# EAGLE design kolrs868_rx (EAGLE 6.4)
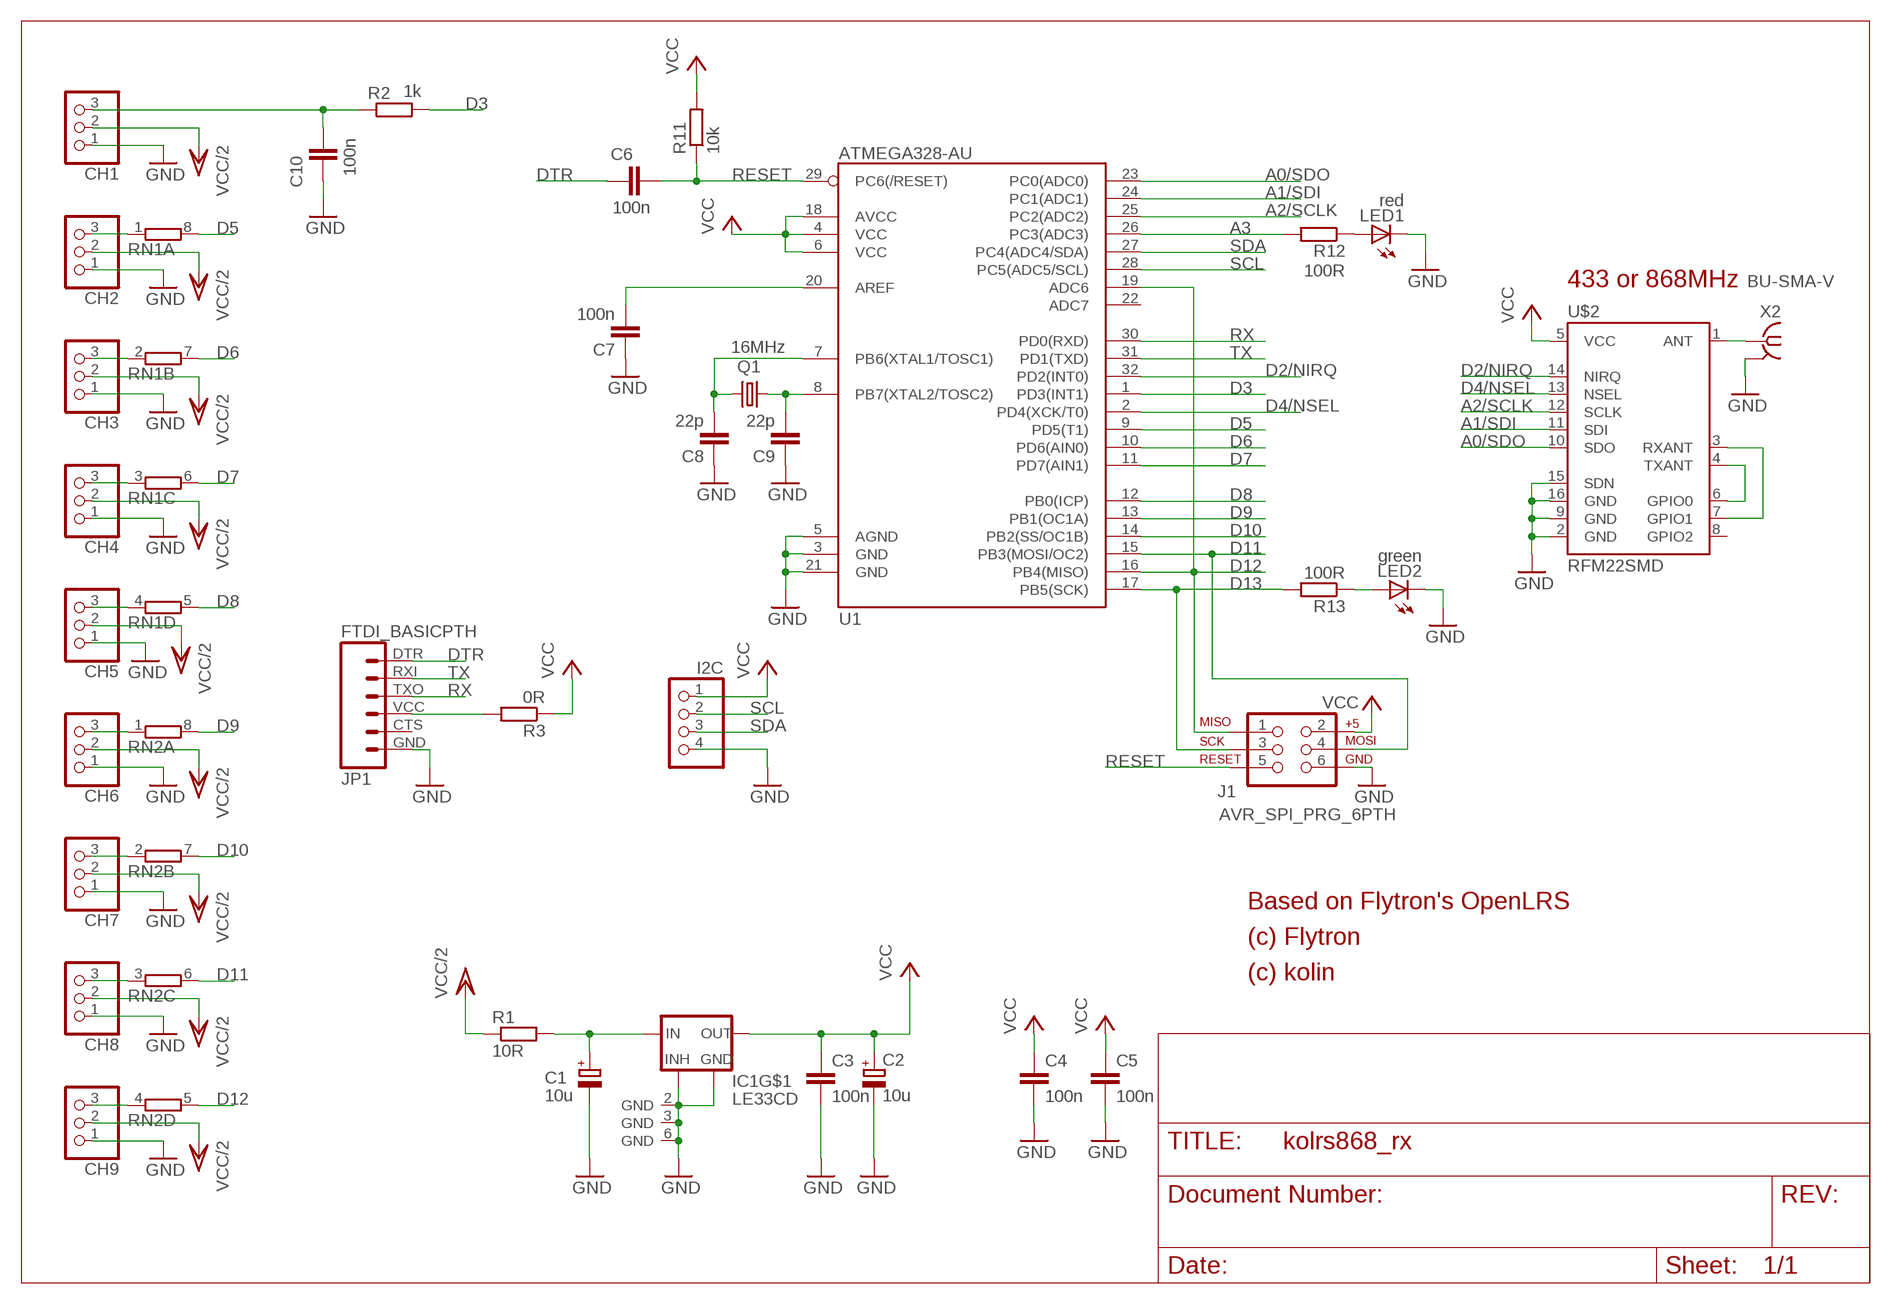
[diagram p0: schematic, sheet 1]

## Parts
C1  10u  CPOL-EUSMCB  [SMC_B]
C2  10u  CPOL-EUSMCB  [SMC_B]
C3  100n  C-EU_KOLIN  [M0805]
C4  100n  C-EU_KOLIN  [M0805]
C5  100n  C-EU_KOLIN  [M0805]
C6  100n  C-EU_KOLIN  [M0805]
C7  100n  C-EU_KOLIN  [M0805]
C8  22p  C-EU_KOLIN  [M0805]
C9  22p  C-EU_KOLIN  [M0805]
C10  100n  C-EU_KOLIN  [M0805]
CH1  PINHD-1X3_KOLINOVO  [1X03]
CH2  PINHD-1X3_KOLINOVO  [1X03]
CH3  PINHD-1X3_KOLINOVO  [1X03]
CH4  PINHD-1X3_KOLINOVO  [1X03]
CH5  PINHD-1X3_KOLINOVO  [1X03]
CH6  PINHD-1X3_KOLINOVO  [1X03]
CH7  PINHD-1X3_KOLINOVO  [1X03]
CH8  PINHD-1X3_KOLINOVO  [1X03]
CH9  PINHD-1X3_KOLINOVO  [1X03]
I2C  PINHD-1X4  [1X04]
IC1  LE33CD  [SO8]
J1  AVR_SPI_PRG_6PTH  [2X3]
JP1  FTDI_BASICPTH  [FTDI_BASIC]
LED1  red  LEDCHIPLED_0805  [CHIPLED_0805]
LED2  green  LEDCHIPLED_0805  [CHIPLED_0805]
Q1  16MHz  CRYSTALHC49UP  [HC49UP]
R1  10R  R-EU_KOLINM0805  [M0805]
R2  1k  R-EU_KOLINM0805  [M0805]
R3  0R  R-EU_KOLINM0805  [M0805]
R11  10k  R-EU_KOLINM0805  [M0805]
R12  100R  R-EU_KOLINM0805  [M0805]
R13  100R  R-EU_KOLINM0805  [M0805]
RN1  4R-NCAY16  [CAY16]
RN2  4R-NCAY16  [CAY16]
U1  ATMEGA328-AU  ATMEGA168  [TQFP32-08]
U$2  RFM22SMD  [RFM22-XXX-S2]
X2  BU-SMA-V  [BU-SMA-V]

## Nets
A0/SDO: U1.23(PC0(ADC0)) U$2.10(SDO)
A1/SDI: U1.24(PC1(ADC1)) U$2.11(SDI)
A2/SCLK: U1.25(PC2(ADC2)) U$2.12(SCLK)
A3: R12.2 U1.26(PC3(ADC3))
D2/NIRQ: U1.32(PD2(INT0)) U$2.14(NIRQ)
D3: R2.2 U1.1(PD3(INT1))
D4/NSEL: U1.2(PD4(XCK/T0)) U$2.13(NSEL)
D5: RN1.8 U1.9(PD5(T1))
D6: RN1.7 U1.10(PD6(AIN0))
D7: RN1.6 U1.11(PD7(AIN1))
D8: RN1.5 U1.12(PB0(ICP))
D9: RN2.8 U1.13(PB1(OC1A))
D10: RN2.7 U1.14(PB2(SS/OC1B))
D11: J1.4 RN2.6 U1.15(PB3(MOSI/OC2))
D12: J1.1 RN2.5 U1.16(PB4(MISO)) U1.19(ADC6)
D13: J1.3 R13.2 U1.17(PB5(SCK))
DTR: C6.1 JP1.DTR
GND: C1.- C2.- C3.2 C4.2 C5.2 C7.1 C8.1 C9.1 C10.1 CH1.1 CH2.1 CH3.1 CH4.1 CH5.1 CH6.1 CH7.1 CH8.1 CH9.1 I2C.4 IC1.2(GND) IC1.3(GND) IC1.5(INHIBIT) IC1.6(GND) IC1.7(GND) J1.6 JP1.GND LED1.C LED2.C U1.3(GND) U1.5(AGND) U1.21(GND) U$2.2(GND) U$2.9(GND) U$2.15(SDN) U$2.16(GND) X2.2(GND)
N$1: C7.2 U1.20(AREF)
N$2: U$2.4(TXANT) U$2.6(GPIO0)
N$3: U$2.3(RXANT) U$2.7(GPIO1)
N$4: U$2.1(ANT) X2.1
N$5: LED1.A R12.1
N$6: C8.2 Q1.2 U1.7(PB6(XTAL1/TOSC1))
N$7: C9.2 Q1.1 U1.8(PB7(XTAL2/TOSC2))
N$8: JP1.VCC R3.2
N$9: C1.+ IC1.8(IN) R1.2
N$11: CH5.3 RN1.4
N$12: C10.2 CH1.3 R2.1
N$14: CH2.3 RN1.1
N$15: CH3.3 RN1.2
N$16: CH4.3 RN1.3
N$17: CH6.3 RN2.1
N$18: CH7.3 RN2.2
N$19: CH8.3 RN2.3
N$20: CH9.3 RN2.4
N$25: LED2.A R13.1
RESET: C6.2 J1.5 R11.1 U1.29(PC6(/RESET))
RX: JP1.TXO U1.30(PD0(RXD))
SCL: I2C.2 U1.28(PC5(ADC5/SCL))
SDA: I2C.3 U1.27(PC4(ADC4/SDA))
TX: JP1.RXI U1.31(PD1(TXD))
VCC: C2.+ C3.1 C4.1 C5.1 I2C.1 IC1.1(OUT) J1.2 R3.1 R11.2 U1.4(VCC) U1.6(VCC) U1.18(AVCC) U$2.5(VCC)
VCC/2: CH1.2 CH2.2 CH3.2 CH4.2 CH5.2 CH6.2 CH7.2 CH8.2 CH9.2 R1.1
Unconnected: JP1.CTS U1.22(ADC7) U$2.8(GPIO2)

## Notes on the sheet
- 433 or 868MHz
- Based on Flytron's OpenLRS
- (c) Flytron
- (c) kolin

## Power pins joined to a net without a drawn wire
GND: X2.3(GND) X2.4(GND) X2.5(GND)

## Library data of the parts
C1 C2 = rcl:CPOL-EU: POLARIZED CAPACITOR, European symbol
C3-C10 = PINHEAD_RC:C-EU_KOLIN: CAPACITOR, European symbol
CH1-CH9 = PINHEAD_RC:PINHD-1X3_KOLINOVO: KOLINOVO PIN HEADER
I2C = pinhead:PINHD-1X4: PIN HEADER
IC1 = libstabilizatory:LE33CD: VOLTAGE REGULATOR WITH INHIBIT
J1 = SparkFun:AVR_SPI_PRG_6: AVR ISP 6 Pin This is the reduced ISP connector for AVR programming. Common on Arduino. This footprint will take up less PCB space and can be used with a 10-pin to 6-pin adapter such as SKU: BOB-08508
JP1 = SparkFun:FTDI_BASIC: FTDI Basic: 3.3V and 5V
LED1 LED2 = led:LED: LED OSRAM: - CHIPLED LG R971, LG N971, LY N971, LG Q971, LY Q971, LO R971, LY R971 LH N974, LH R974 LS Q976, LO Q976, LY Q976 LO Q996 - Hyper CHIPLED LW Q18S LB Q993, LB Q99A, LB R99A - SideLED LS A670, LO A670, LY A670, LG A670, LP A670 LB A673, LV A673, LT A673, LW A673 LH A674 LY A675 LS A676, LA A676, LO A676, LY A676, LW A676 LS A679, LY A679, LG A679 - Hyper Micro SIDELED® LS Y876, LA Y876, LO Y876, LY Y876 LT Y87S - SmartLED LW L88C, LW L88S LB L89C, LB L89S, LG L890 LS L89K, LO L89K, LY L89K LS L896, LA L896, LO L896, LY L896 - TOPLED LS T670, LO T670, LY T670, LG T670, LP T670 LSG T670, LSP T670, LSY T670, LOP T670, LYG T670 LG T671, LOG T671, LSG T671 LB T673, LV T673, LT T673, LW T673 LH T674 LS T676, LA T676, LO T676, LY T676, LB T676, LH T676, LSB T676, LW T676 LB T67C, LV T67C, LT T67C, LS T67K, LO T67K, LY T67K, LW E67C LS E67B, LA E67B, LO E67B, LY E67B, LB E67C, LV E67C, LT E67C LW T67C LS T679, LY T679, LG T679 LS T770, LO T770, LY T770, LG T770, LP T770 LB T773, LV T773, LT T773, LW T773 LH T774 LS E675, LA E675, LY E675, LS T675 LS T776, LA T776, LO T776, LY T776, LB T776 LHGB T686 LT T68C, LB T68C - Hyper Mini TOPLED® LB M676 - Mini TOPLED Santana® LG M470 LS M47K, LO M47K, LY M47K Source: http://www.osram.convergy.de LUXEON: - LUMILED® LXK2-PW12-R00, LXK2-PW12-S00, LXK2-PW14-U00, LXK2-PW14-V00 LXK2-PM12-R00, LXK2-PM12-S00, LXK2-PM14-U00 LXK2-PE12-Q00, LXK2-PE12-R00, LXK2-PE12-S00, LXK2-PE14-T00, LXK2-PE14-U00 LXK2-PB12-K00, LXK2-PB12-L00, LXK2-PB12-M00, LXK2-PB14-N00, LXK2-PB14-P00, LXK2-PB14-Q00 LXK2-PR12-L00, LXK2-PR12-M00, LXK2-PR14-Q00, LXK2-PR14-R00 LXK2-PD12-Q00, LXK2-PD12-R00, LXK2-PD12-S00 LXK2-PH12-R00, LXK2-PH12-S00 LXK2-PL12-P00, LXK2-PL12-Q00, LXK2-PL12-R00 Source: www.luxeon.com KINGBRIGHT: KA-3528ASYC Source: www.kingbright.com
Q1 = crystal:CRYSTAL: CRYSTAL; OC_FARNELL: unknown; OC_NEWARK: unknown
R1-R3 R11-R13 = PINHEAD_RC:R-EU_KOLIN: RESISTOR, European symbol
RN1 RN2 = resistor-dil:4R-N: Array Chip Resistor Source: RS Component / Phycomp; OC_FARNELL: unknown; OC_NEWARK: unknown
U1 = SparkFun:ATMEGA168
U$2 = SparkFun:RFM22: Description: The RFM22 is a low-power, low cost radio that is capable of operating in the 434MHz and 900MHz open bands. It's frequency is software defined and there are some very good libraries written for it.
X2 = con-coax:BU-SMA-V: FEMALE SMA CONNECTOR Radiall distributor RS 112-3794; OC_FARNELL: unknown; OC_NEWARK: unknown

## Board
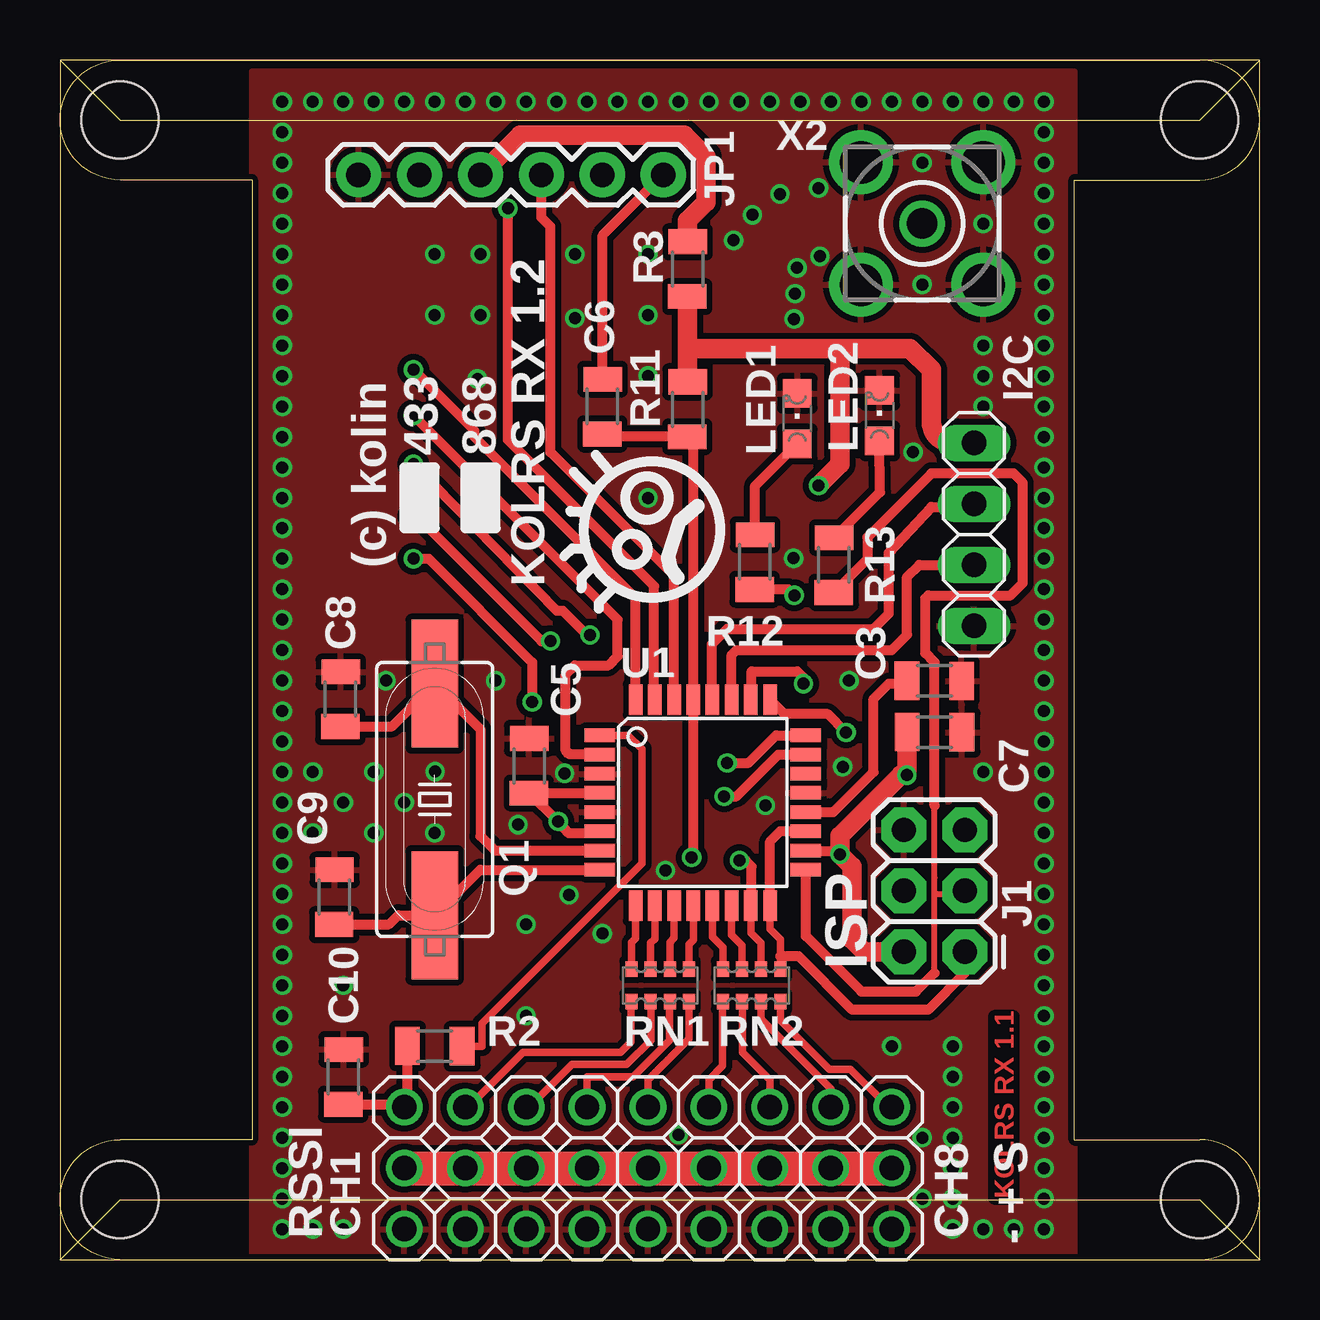
[diagram p1: board, top side]
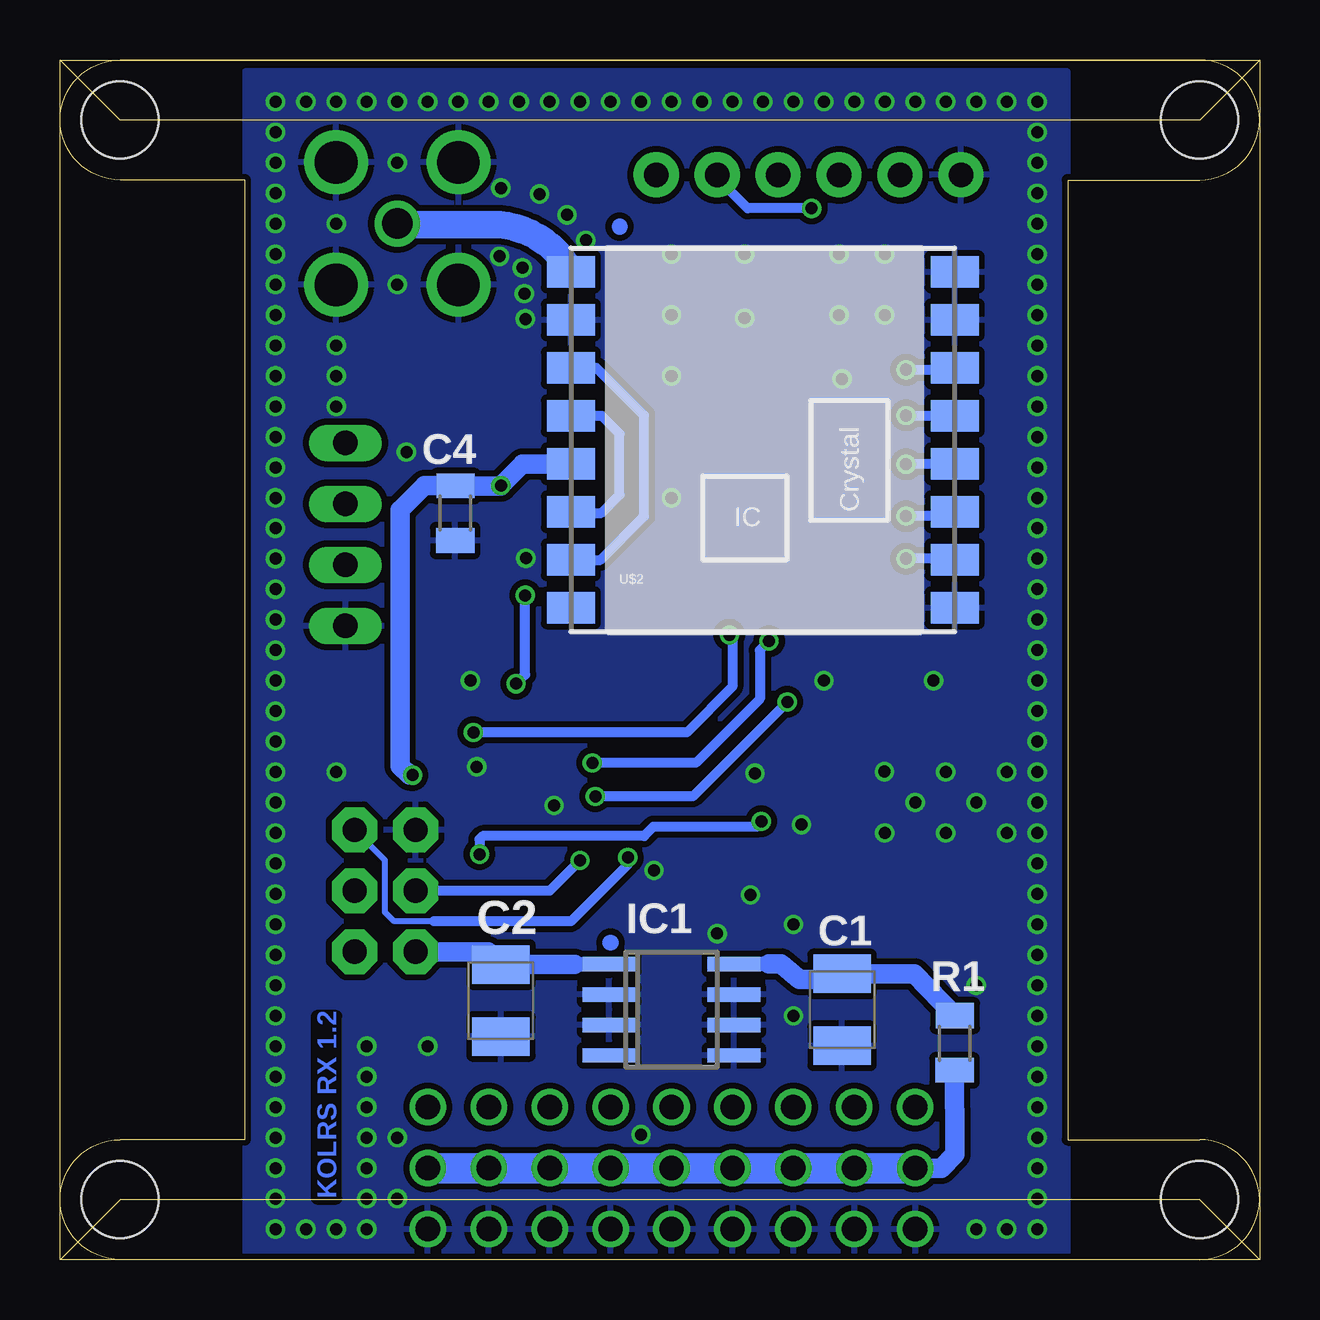
[diagram p2: board, bottom side, seen from below]

Size 50 x 50 mm. Coordinates in mm from the lower left corner, seen from the top.
Outline: 2.5,0 47.5,0 arc180 47.5,5 42.29,5 42.29,45 47.5,45 arc180 47.5,50 2.5,50 arc180 2.5,45 8,45 8,5 2.5,5 arc180 2.5,0
Copper layers (1*16): Top 0.035mm / dielectric 1.5mm / Bottom 0.035mm
Design rules "ITEADstudio_DRC": minimum track width 6mil, minimum drill 12mil, track to track 6mil, track to pad 6mil, pad to pad 6mil, via to via 6mil, smd to smd 0mil, copper to edge 10mil, drill to drill 10mil, minimum pad ring 10mil, minimum via ring 6mil, stop-mask expansion 2mil, vias tented up to drill 100mil, thermal gap 10mil
Holes 3.2 mm at 2.5,2.5 47.5,2.5 47.5,47.5 2.5,47.5
Milling: 10 lines

### Footprints (pad centres in the part's own frame; a part is rotated, then mirrored left to right if it is on the bottom)
SMC_B = smd 1.6 x 2.4: + -1.5,0; - 1.5,0
M0805 = smd 1.021 x 1.6: 1 -1.131,0.017 | smd 1.046 x 1.6: 2 1.148,0
1X03 = drill 1.016: 1 -2.54,0; 2 0,0; 3 2.54,0
1X04 = drill 1.016 long: 1 -3.81,0; 2 -1.27,0; 3 1.27,0; 4 3.81,0
SO8 = smd 0.6 x 2.2: 1 -1.905,-2.6; 2 -0.635,-2.6; 3 0.635,-2.6; 4 1.905,-2.6; 5 1.905,2.6; 6 0.635,2.6; 7 -0.635,2.6; 8 -1.905,2.6
2X3 = drill 1.016 pad 1.88 octagon: 1 0,0; 2 0,2.54; 3 2.54,0; 4 2.54,2.54; 5 5.08,0; 6 5.08,2.54
FTDI_BASIC = drill 1.016 pad 1.88: CTS 10.16,0; DTR 0,0; GND 12.7,0; RXI 2.54,0; TXO 5.08,0; VCC 7.62,0
CHIPLED_0805 = smd 1.2 x 1.2: A 0,-1.05; C 0,1.05
HC49UP = smd 5.334 x 1.93: 1 -4.826,0; 2 4.826,0
CAY16 = smd 0.5 x 0.65: 1 -1.2,-0.675; 2 -0.4,-0.675; 3 0.4,-0.675; 4 1.2,-0.675; 5 1.2,0.675; 6 0.4,0.675; 7 -0.4,0.675; 8 -1.2,0.675
TQFP32-08 = smd 1.27 x 0.559: 1 -4.293,2.8; 2 -4.293,2; 3 -4.293,1.2; 4 -4.293,0.4; 5 -4.293,-0.4; 6 -4.293,-1.2; 7 -4.293,-2; 8 -4.293,-2.8; 17 4.293,-2.8; 18 4.293,-2; 19 4.293,-1.2; 20 4.293,-0.4; 21 4.293,0.4; 22 4.293,1.2; 23 4.293,2; 24 4.293,2.8 | smd 0.559 x 1.27: 9 -2.8,-4.293; 10 -2,-4.293; 11 -1.2,-4.293; 12 -0.4,-4.293; 13 0.4,-4.293; 14 1.2,-4.293; 15 2,-4.293; 16 2.8,-4.293; 25 2.8,4.293; 26 2,4.293; 27 1.2,4.293; 28 0.4,4.293; 29 -0.4,4.293; 30 -1.2,4.293; 31 -2,4.293; 32 -2.8,4.293
RFM22-XXX-S2 = smd 2 x 1.3: 1 -8,7; 2 -8,5; 3 -8,3; 4 -8,1; 5 -8,-1; 6 -8,-3; 7 -8,-5; 8 -8,-7; 9 8,-7; 10 8,-5; 11 8,-3; 12 8,-1; 13 8,1; 14 8,3; 15 8,5; 16 8,7
BU-SMA-V = drill 1.27: 1 0,0 | drill 1.778: 2 -2.55,2.55; 3 2.55,2.55; 4 2.55,-2.55; 5 -2.55,-2.55

### Placement (x,y rotation side)
C1  17.4,10.41 270 bottom
C2  31.62,10.79 270 bottom
C3  36.45,21.97 0 top
C4  33.53,31.11 270 bottom
C5  19.56,20.57 90 top
C6  22.61,35.56 270 top
C7  36.45,24.13 180 top
C8  11.68,23.37 270 top
C9  11.43,15.11 270 top
C10  11.81,7.62 270 top
CH1  14.35,3.81 90 top
CH2  16.89,3.81 90 top
CH3  19.43,3.81 90 top
CH4  21.97,3.81 90 top
CH5  24.51,3.81 90 top
CH6  27.05,3.81 90 top
CH7  29.59,3.81 90 top
CH8  32.13,3.81 90 top
CH9  34.67,3.81 90 top
I2C  38.1,30.23 270 top
IC1  24.51,10.41 270 bottom
J1  37.72,12.83 90 top
JP1  25.14,45.21 180 top
LED1  30.73,35.05 0 top
LED2  34.16,35.18 0 top
Q1  15.62,19.18 90 top
R1  12.7,9.02 90 bottom
R2  15.62,8.89 0 top
R3  26.16,41.27 90 top
R11  26.16,35.43 90 top
R12  28.95,29.08 270 top
R13  32.26,28.96 270 top
RN1  25.02,11.43 0 top
RN2  28.83,11.43 0 top
U1  26.8,19.05 0 top
U$2  20.7,34.16 0 bottom
X2  35.94,43.18 0 top

### Tracks (layer width: path | path; a pad name or v marks a point on that pad's centre or on a via)
A0/SDO  (via drill 0.5)
  Top 0.406: v14.73,29.21 15.37,29.21 19.68,24.89 v19.68,23.24 | U1.23 29.94,21.05 28.19,19.3 v27.68,19.3
  Bottom 0.406: U$2.10 12.75,29.21 v14.73,29.21 | v27.68,19.3 23.62,19.3 v19.68,23.24
A1/SDI  (via drill 0.5)
  Top 0.406: v14.73,30.99 14.86,30.99 20.06,25.78 v20.45,25.78 | U1.24 29.84,21.84 28.7,20.7 v27.81,20.7
  Bottom 0.406: U$2.11 12.88,30.99 v14.73,30.99 | v20.45,25.78 20.83,25.4 20.83,23.37 23.49,20.7 v27.81,20.7
A2/SCLK  (via drill 0.5)
  Top 0.406: U1.25 30.21,22.73 32,22.73 v32.77,21.97 | v14.73,33.15 20.7,27.05 20.95,27.05 21.97,26.04 v22.1,26.04
  Bottom 0.406: U$2.12 12.72,33.15 v14.73,33.15 | v22.1,26.04 21.97,25.91 21.97,23.88 23.88,21.97 v32.77,21.97
A3  (via drill 0.5)
  Top 0.406: U1.26 28.83,23.38 28.83,24.51 30.73,24.51 30.99,24.26 v30.99,24 | v30.61,27.69 30.36,27.93 R12.2
  Bottom 0.406: v30.99,24 30.61,24.38 v30.61,27.69
D2/NIRQ  (via drill 0.5)
  Top 0.406: U1.32 24,27.57 17.27,34.29 17.27,34.54 v14.73,37.08
  Bottom 0.406: U$2.14 12.78,37.08 v14.73,37.08
D3
  Top 0.305: R2.2 17.59,8.89 17.59,9.84 24.26,16.51 24.26,21.27 23.68,21.85 U1.1
D4/NSEL  (via drill 0.5)
  Top 0.406: U1.2 22.47,21.08 21.21,21.08 21.08,21.21 21.08,24.38 21.46,24.77 22.86,24.77 23.24,25.15 23.24,26.67 v14.73,35.18
  Bottom 0.406: v14.73,35.18 12.72,35.18 U$2.13
D5
  Top 0.305: U1.9 24,13.39 23.82,13.21 RN1.8
D6
  Top 0.305: U1.10 24.8,13.37 24.62,13.19 RN1.7
D7
  Top 0.305: U1.11 25.6,13.4 25.42,13.23 RN1.6
D8
  Top 0.305: U1.12 26.4,13.32 26.22,13.14 RN1.5
D9
  Top 0.305: U1.13 27.2,13.44 27.63,13.01 RN2.8
D10
  Top 0.305: U1.14 28,13.53 28.43,13.1 RN2.7
D11  (via drill 0.5)
  Top 0.305: U1.15 28.8,13.62 29.23,13.19 RN2.6
  Top 0.406: U1.15 28.83,14.79 28.83,16.38 28.57,16.64 v28.32,16.64
  Bottom 0.406: v28.32,16.64 29.59,15.37 J1.4
D12
  Top 0.305: U1.16 29.6,13.77 30.04,13.34 30.03,13.33 30.03,12.64 RN2.5
  Top 0.406: U1.19 31.08,17.86 30.03,17.86 29.6,17.43 U1.16 | J1.1 37.72,11.94 36.19,10.41 33.02,10.41 30.8,12.64 30.03,12.64
D13
  Top 0.254: 36.45,18.92 36.45,15.93 36.45,15.24 | 36.45,11.94 36.45,15.24 | 36.45,15.24 37.59,15.24
  Top 0.305: 36.45,18.92 | 37.59,15.24 J1.3
  Top 0.406: U1.17 31.09,13.49 33.4,11.18 35.69,11.18 36.45,11.94 | R13.2 33.65,29.2 33.65,30.1 36.32,32.77 39.75,32.77 40.13,32.38 40.13,28.19 39.62,27.69 36.19,27.69 36.07,27.56 36.07,25.27 36.45,24.89 36.45,18.92
DTR
  Top 0.406: JP1.DTR 22.62,42.69 C6.1
GND  (via drill 0.5)
  other vias: 29.41,18.93 9.27,1.27 9.27,3.81 9.27,6.35 9.27,8.89 9.27,11.43 9.27,13.97 9.27,16.51 9.27,19.05 11.81,19.05 14.35,19.05 19.43,13.97 9.27,21.59 9.27,24.13 9.27,26.67 9.27,29.21 9.27,31.75 9.27,34.29 9.27,39.37 9.27,41.91 9.27,44.45 9.27,46.99 10.54,48.26 15.62,48.26 18.16,48.26 20.7,48.26 23.24,48.26 25.78,48.26 28.32,48.26 30.86,48.26 33.4,48.26 35.94,48.26 38.48,48.26 41.02,48.26 18.16,24.13 30.01,44.41 35.94,40.64 38.48,43.18 35.94,45.72 41.02,45.72 41.02,43.18 41.02,40.64 41.02,38.1 38.48,38.1 41.02,35.56 38.48,35.56 41.02,33.02 41.02,30.48 41.02,27.94 41.02,25.4 41.02,22.86 38.48,20.32 41.02,17.78 41.02,15.24 41.02,12.7 41.02,10.16 41.02,7.62 35.94,5.08 41.02,5.08 41.02,2.54 35.94,2.54 11.81,11.43 19.09,18.13 21.22,15.19 32.63,20.54 30.58,29.23 24.51,31.75 24.51,36.83 24.51,39.37 24.51,41.91 15.62,41.91 15.62,39.37 13.08,48.26 9.27,36.83 21.46,39.24 21.46,41.91 17.52,39.37 17.52,41.91 17.4,36.7 13.59,24.13 22.61,13.59 32.89,24.13 9.27,20.32 9.27,17.78 9.27,15.24 9.27,12.7 9.27,10.16 9.27,7.62 9.27,5.08 9.27,2.54 9.27,22.86 9.27,25.4 9.27,27.94 9.27,30.48 9.27,33.02 9.27,35.56 9.27,38.1 9.27,40.64 9.27,43.18 9.27,45.72 9.27,48.26 11.81,48.26 14.35,48.26 16.89,48.26 19.43,48.26 21.97,48.26 24.51,48.26 27.05,48.26 29.59,48.26 32.13,48.26 34.67,48.26 37.21,48.26 39.75,48.26 41.02,46.99 41.02,44.45 41.02,41.91 41.02,39.37 41.02,36.83 41.02,34.29 41.02,31.75 41.02,29.21 41.02,26.67 41.02,24.13 41.02,19.05 41.02,16.51 41.02,13.97 41.02,11.43 41.02,8.89 41.02,6.35 41.02,3.81 41.02,1.27 15.62,17.78 13.08,17.78 10.54,17.78 10.54,20.32 13.08,20.32 21.03,20.27 31.62,44.66 28.86,43.55 28.08,42.48 30.6,39.2 30.65,40.26 30.73,41.33 31.68,41.82 25.24,16.22 15.63,20.34 41.02,21.59 41.02,20.32 25.78,5.21 37.21,8.89 37.21,7.62 37.21,6.35 37.21,5.08 37.21,3.81 37.21,2.54 35.56,33.66 38.48,36.83 39.75,1.27 38.48,1.27 37.21,1.27 34.67,8.89 19.43,10.16 10.54,1.27 11.81,1.27
  pour Bottom (isolate 0.254): 8,49.53 42.29,49.53 42.29,0 8,0
  pour Top (isolate 0.254): 8,49.53 42.29,49.53 42.29,0 8,0
N$1
  Top 0.406: C7.2 35.17,24 34.54,24 33.91,23.37 33.91,20.32 32.24,18.65 U1.20
N$2
  Bottom 0.406: U$2.4 27.41,35.16 26.67,34.42 26.67,31.88 27.43,31.11 28.65,31.11 U$2.6
N$3
  Bottom 0.406: U$2.3 27.64,37.16 25.65,35.18 25.65,30.99 27.48,29.16 U$2.7
N$4
  Bottom 1.143: U$2.1 arc-62 32.02,43.15 35.91,43.15
  Bottom 1.27: 35.91,43.15 arc90 X2.1
N$5
  Top 0.406: R12.1 28.97,32.24 LED1.A
N$6
  Top 0.406: C8.2 13.84,22.23 Q1.2 17.52,22.1 17.52,17.65 18.13,17.05 U1.7
N$7
  Top 0.406: C9.2 13.71,13.97 14.1,14.35 Q1.1 17.52,16.25 U1.8
N$8
  Top 0.813: JP1.VCC 19.18,46.86 26.03,46.86 26.92,45.97 26.92,44.07 26.16,43.31 R3.2
N$9
  Bottom 0.61: IC1.8 20.45,12.32
  Bottom 0.813: R1.2 14.38,11.91 C1.+ | C1.+ 17.8,12.06 | 20.45,12.32 19.94,12.32 19.18,11.68 17.42,11.68 C1.+
N$11
  Top 0.305: CH5.3 24.51,7.49 26.22,9.21 26.22,10.73 RN1.4
N$12
  Top 0.406: C10.2 14.23,6.47 CH1.3 14.49,6.49 R2.1
N$14
  Top 0.305: CH2.3 17.08,6.41 19.3,8.64 23.37,8.64 23.81,9.08 23.81,10.73 RN1.1
N$15
  Top 0.305: CH3.3 19.62,6.41 21.34,8.13 23.62,8.13 24.64,9.14 24.64,10.73 RN1.2
N$16
  Top 0.305: CH4.3 21.97,7.62 23.88,7.62 25.4,9.14 25.4,10.73 RN1.3
N$17
  Top 0.305: CH6.3 27.05,7.49 27.62,8.06 27.62,10.73 RN2.1
N$18
  Top 0.305: CH7.3 29.59,7.49 28.45,8.64 28.45,10.73 RN2.2
N$19
  Top 0.305: CH8.3 32.13,7.11 29.21,10.03 29.21,10.73 RN2.3
N$20
  Top 0.305: RN2.4 30.04,10.73 30.04,9.97 32.07,7.94 32.96,7.94 34.48,6.41 CH9.3
N$25
  Top 0.406: LED2.A 34.18,31.99 R13.1
RESET  (via drill 0.5)
  Top 0.406: C6.2 22.71,34.3 R11.1 26.4,34.05 U1.29 26.41,23.32 26.41,16.84 v26.33,16.76
  Bottom 0.254: 34.42,14.1 36.07,14.1 36.45,14.48 36.45,16.64 J1.5
  Bottom 0.406: 34.42,14.1 28.7,14.1 26.33,16.47 v26.33,16.76
RX
  Top 0.406: U1.30 25.59,23.35 25.59,28.52 20.45,33.66 20.45,43.05 20.06,43.43 JP1.TXO
SCL
  Top 0.406: U1.28 27.18,23.36 27.18,25.65 27.81,26.29 33.91,26.29 34.54,26.92 34.54,29.46 36.32,31.37 37.97,31.37 I2C.2
SDA
  Top 0.406: U1.27 28,25.2 28.19,25.4 34.67,25.4 35.3,26.04 35.3,28.45 35.81,28.96 I2C.3
TX  (via drill 0.5)
  Top 0.406: U1.31 24.76,23.38 24.76,28.07 18.67,34.16 v18.67,43.81
  Bottom 0.406: v18.67,43.81 21.34,43.81 22.61,45.09 JP1.RXI
VCC  (via drill 0.5)
  Top 0.406: U1.4 C5.1 v20.77,18.26 21.21,17.78 22.43,17.78 U1.6 | U1.18 31.12,17.02 32.38,17.02 v32.51,16.89
  Top 0.813: 26.16,38.23 R11.2 | 36.32,34.92 36.32,37.08 35.43,37.97 32.51,37.97 | 36.32,34.92 36.32,34.8 | 32.51,37.97 26.41,37.97 26.16,38.23 | 32.51,37.97 32.51,33.15 v31.62,32.26 | J1.2 33.53,12.83 33.02,13.34 33.02,16.38 v32.51,16.89 32.51,17.65 35.05,20.19 v35.3,20.19 35.3,21.98 C3.1 | I2C.1 37.21,34.04 arc-90 36.32,34.92 | 26.16,38.23 26.16,40.14 R3.1
  Bottom 0.406: v20.77,18.26 20.95,18.03 25.27,18.03 25.65,17.65 32.38,17.65 32.51,17.53 v32.51,16.89
  Bottom 0.61: 28.55,12.29 27.13,12.29 IC1.1
  Bottom 0.813: 28.55,12.29 C2.+ 32.15,12.83 J1.2 | 28.73,33.13 U$2.5 30.72,33.16 v31.62,32.26 31.63,32.25 C4.1 33.52,32.26 34.8,32.26 35.81,31.24 35.81,20.57 35.43,20.19 v35.3,20.19
VCC/2
  Top 1.422: CH1.2 CH2.2 CH3.2 CH4.2 CH5.2 CH6.2 CH7.2 CH8.2 CH9.2
  Bottom 0.813: CH1.2 14.22,3.81 13.27,3.81 12.7,4.38 12.7,6.1 12.71,6.49 R1.1
  Bottom 1.27: 14.22,3.81 CH2.2 CH3.2 CH4.2 CH5.2 CH6.2 CH7.2 CH8.2 CH9.2
(copper drawn outside any net)
  shapes: Bottom circle x2

### Text on the board
Top: KOLRS RX 1.1
Bottom: KOLRS RX 1.2
tNames: 433 | 868 | (c) kolin | KOLRS RX 1.2 | ISP | RSSI | CH8 | - + S